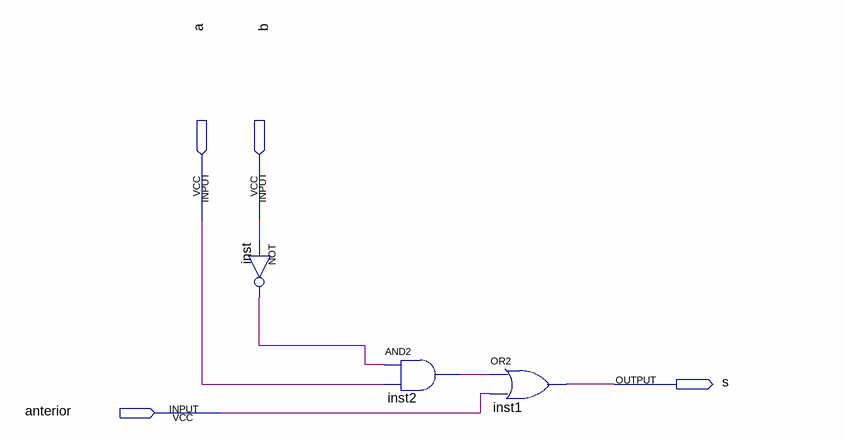
[diagram p0: schematic sheet]
// Quartus schematic maiorq_1bit.bdf as structural Verilog: 3 symbols, 4 pins
module maiorq_1bit (
  input  a,
  input  b,
  input  anterior,
  output s
);

  wire inst2_out, inst_out;

  not inst (inst_out, b);
  and inst2 (inst2_out, inst_out, a);
  or inst1 (s, inst2_out, anterior);
endmodule
